# EAGLE schematic Nixie Test (EAGLE 6.5.0)

## Sheet 1 of 17
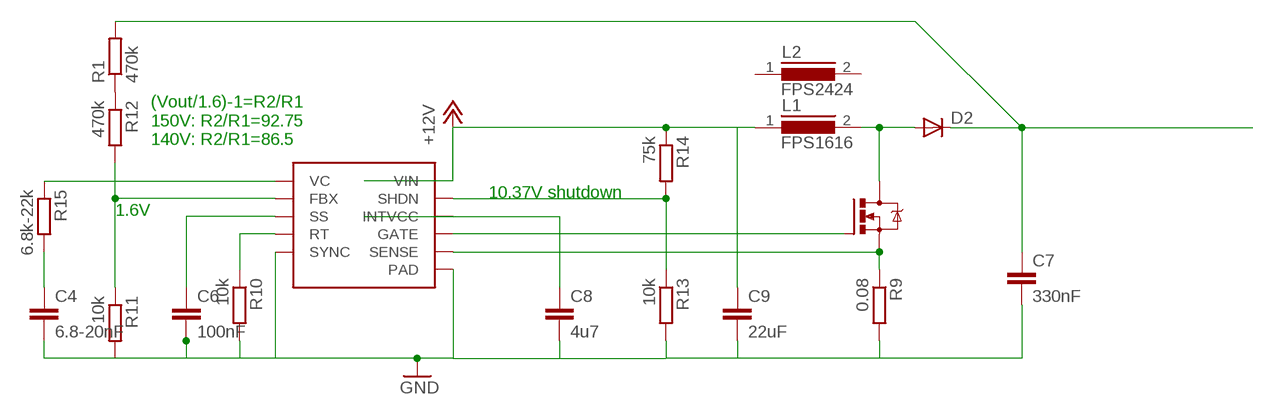
[diagram p0: schematic, sheet 1]

### Parts
C4  6.8-20nF  C-EUC0805K  [C0805K]
C6  100nF  C-EUC0805K  [C0805K]
C7  330nF  C-EUC1812  [C1812]
C8  4u7  C-EUC1206K  [C1206K]
C9  22uF  C-EUC1210K  [C1210K]
D2  DIODE-DO219AB  [DO219AB]
L1  FPS1616  [1616FPS_22UH]
L2  FPS2424  [242408FPS_22UH]
Q1  N-MOSFET-TO252-DPAK  [TO252]
R1  470k  R-EU_R0805  [R0805]
R9  0.08  R-EU_R0805  [R0805]
R10  10k  R-EU_R0805  [R0805]
R11  10k  R-EU_R0805  [R0805]
R12  470k  R-EU_R0805  [R0805]
R13  10k  R-EU_R0805  [R0805]
R14  75k  R-EU_R0805  [R0805]
R15  6.8k-22k  R-EU_R0805  [R0805]
U2  LT3757MSOP-10  [MSOP-10]

### Nets
+12V: C9.1 L1.1 R14.1 U2.10(VIN) ; also sheet 2,3,4,5,6,7,8,9,10,11,12
GND: C4.2 C6.2 C7.2 C8.2 C9.2 R9.2 R10.2 R11.2 R13.2 U2.5(SYNC) U2.PAD ; also sheet 2,3,4,5,6,7,8,9,10,11,12,13,14,15,16,17
N$1: R1.1 R12.1
N$19: Q1.1(G) U2.7(GATE)
N$20: R11.1 R12.2 U2.2(FBX)
N$21: D2.A L1.2 Q1.3(D)
N$22: C7.1 D2.C R1.2
N$23: C6.1 U2.3(SS)
N$24: R10.1 U2.4(RT)
N$25: Q1.2(S) R9.1 U2.6(SENSE)
N$26: R13.1 R14.2 U2.9(SHDN)
N$27: C4.1 R15.2
N$28: R15.1 U2.1(VC)
N$29: C8.1 U2.8(INTVCC)
Unconnected: L2.1 L2.2

### Notes on the sheet
- (Vout/1.6)-1=R2/R1
  150V: R2/R1=92.75
  140V: R2/R1=86.5
- 10.37V shutdown
- 1.6V

## Sheet 2 of 17
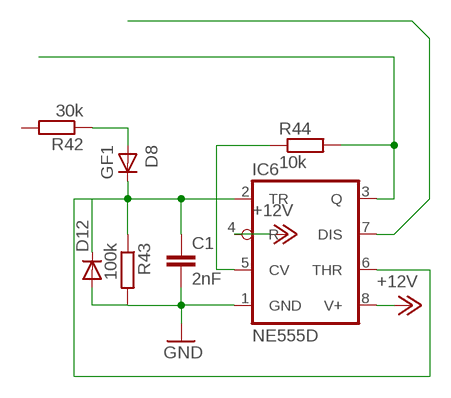
[diagram p1: schematic, sheet 2]

### Parts
C1  2nF  C-EUC1206K  [C1206K]
D8  GF1  [SMA-DO214AC]
D12  DIODE-DO214AA  [DO214AA]
IC6  NE555D  [SO08]
R42  30k  R-EU_R0805  [R0805]
R43  100k  R-EU_R0805  [R0805]
R44  10k  R-EU_R0805  [R0805]

### Nets
+12V: IC6.4(R) IC6.8(V+) ; also sheet 1,3,4,5,6,7,8,9,10,11,12
GND: C1.2 D12.A IC6.1(GND) R43.2 ; also sheet 1,3,4,5,6,7,8,9,10,11,12,13,14,15,16,17
N$2: IC6.7(DIS)
N$84: D8.A R42.1
N$85: IC6.3(Q) R44.2
N$86: IC6.5(CV) R44.1
N$90: C1.1 D8.K(C) D12.C IC6.2(TR) IC6.6(THR) R43.1
Unconnected: R42.2

## Sheet 3 of 17
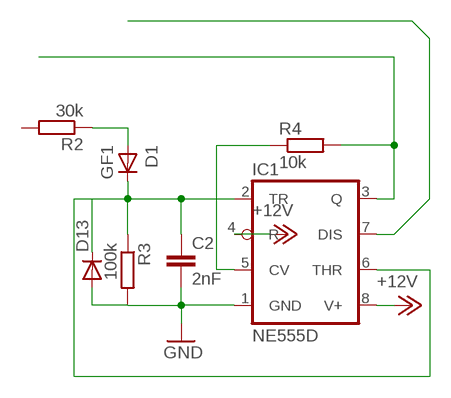
[diagram p2: schematic, sheet 3]

### Parts
C2  2nF  C-EUC1206K  [C1206K]
D1  GF1  [SMA-DO214AC]
D13  DIODE-DO214AA  [DO214AA]
IC1  NE555D  [SO08]
R2  30k  R-EU_R0805  [R0805]
R3  100k  R-EU_R0805  [R0805]
R4  10k  R-EU_R0805  [R0805]

### Nets
+12V: IC1.4(R) IC1.8(V+) ; also sheet 1,2,4,5,6,7,8,9,10,11,12
GND: C2.2 D13.A IC1.1(GND) R3.2 ; also sheet 1,2,4,5,6,7,8,9,10,11,12,13,14,15,16,17
N$10: D1.A R2.1
N$11: IC1.5(CV) R4.1
N$12: C2.1 D1.K(C) D13.C IC1.2(TR) IC1.6(THR) R3.1
N$13: IC1.3(Q) R4.2
N$14: IC1.7(DIS)
Unconnected: R2.2

## Sheet 4 of 17
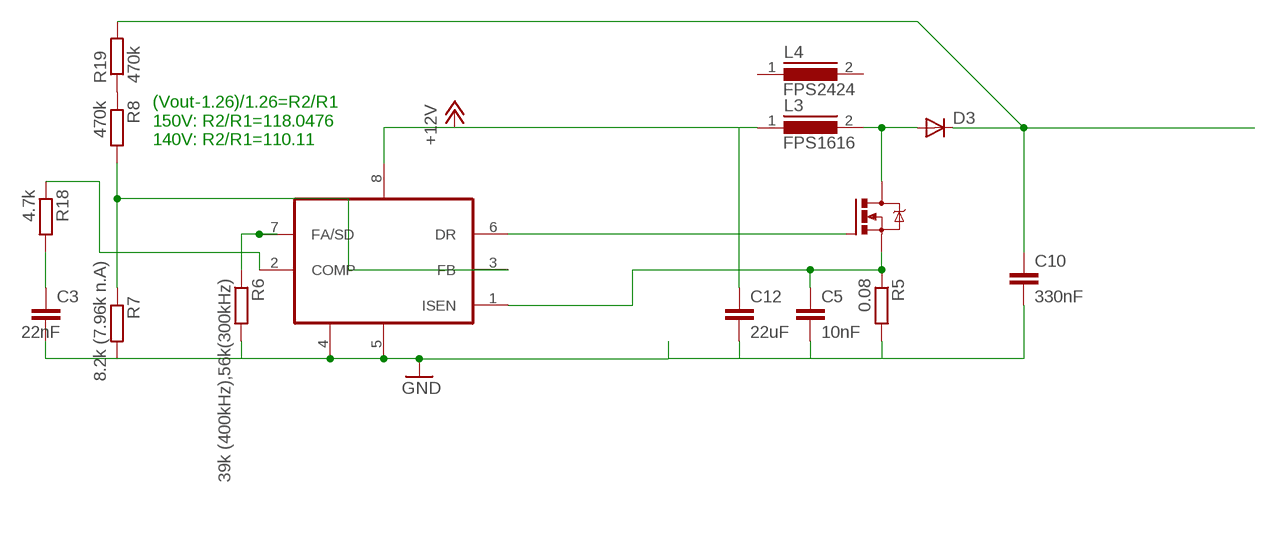
[diagram p3: schematic, sheet 4]

### Parts
C3  22nF  C-EUC0805K  [C0805K]
C5  10nF  C-EUC0805K  [C0805K]
C10  330nF  C-EUC1812  [C1812]
C12  22uF  C-EUC1210K  [C1210K]
D3  DIODE-DO219AB  [DO219AB]
L3  FPS1616  [1616FPS_22UH]
L4  FPS2424  [242408FPS_22UH]
Q2  N-MOSFET-TO252-DPAK  [TO252]
R5  0.08  R-EU_R0805  [R0805]
R6  39k (400kHz),56k(300kHz)  R-EU_R0805  [R0805]
R7  8.2k (7.96k n.A)  R-EU_R0805  [R0805]
R8  470k  R-EU_R0805  [R0805]
R18  4.7k  R-EU_R0805  [R0805]
R19  470k  R-EU_R0805  [R0805]
U3  LM3478  [MSOP08]

### Nets
+12V: C12.1 L3.1 U3.8(VIN) ; also sheet 1,2,3,5,6,7,8,9,10,11,12
GND: C3.2 C5.2 C10.2 C12.2 R5.2 R6.2 R7.2 U3.4(AGND) U3.5(PGND) ; also sheet 1,2,3,5,6,7,8,9,10,11,12,13,14,15,16,17
N$33: Q2.1(G) U3.6(DR)
N$34: R7.1 R8.2 U3.3(FB)
N$35: D3.A L3.2 Q2.3(D)
N$36: C10.1 D3.C R19.2
N$37: R18.1 U3.2(COMP)
N$38: R6.1 U3.7(FA/SD)
N$39: C5.1 Q2.2(S) R5.1 U3.1(ISEN)
N$41: C3.1 R18.2
N$44: R8.1 R19.1
Unconnected: L4.1 L4.2

### Notes on the sheet
- (Vout-1.26)/1.26=R2/R1
  150V: R2/R1=118.0476
  140V: R2/R1=110.11

## Sheet 5 of 17
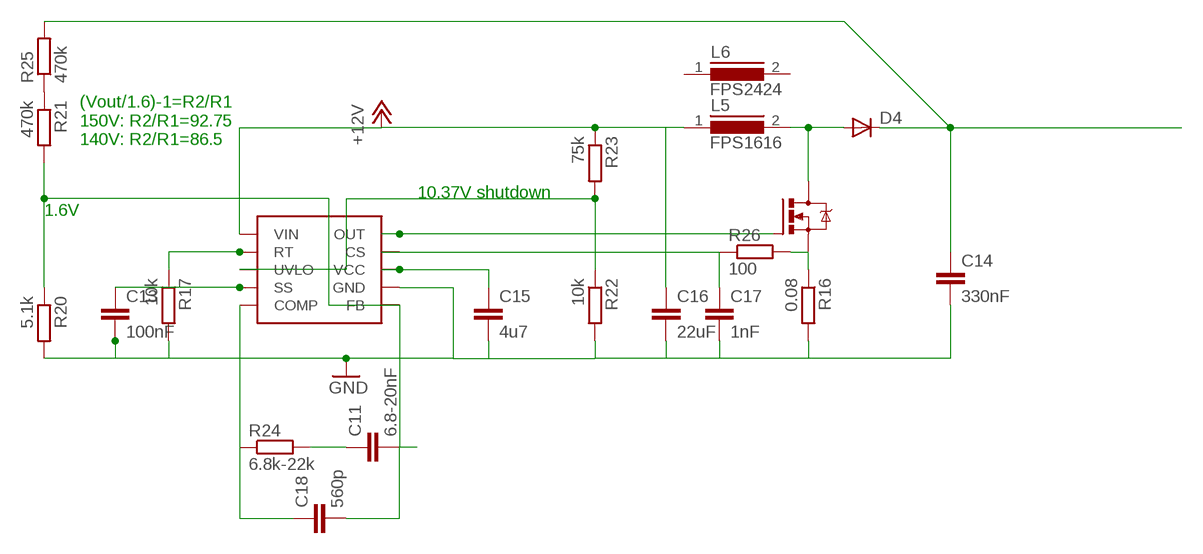
[diagram p4: schematic, sheet 5]

### Parts
C11  6.8-20nF  C-EUC0805K  [C0805K]
C13  100nF  C-EUC0805K  [C0805K]
C14  330nF  C-EUC1812  [C1812]
C15  4u7  C-EUC1206K  [C1206K]
C16  22uF  C-EUC1210K  [C1210K]
C17  1nF  C-EUC0805K  [C0805K]
C18  560p  C-EUC0805K  [C0805K]
D4  DIODE-DO219AB  [DO219AB]
L5  FPS1616  [1616FPS_22UH]
L6  FPS2424  [242408FPS_22UH]
Q3  N-MOSFET-TO252-DPAK  [TO252]
R16  0.08  R-EU_R0805  [R0805]
R17  10k  R-EU_R0805  [R0805]
R20  5.1k  R-EU_R0805  [R0805]
R21  470k  R-EU_R0805  [R0805]
R22  10k  R-EU_R0805  [R0805]
R23  75k  R-EU_R0805  [R0805]
R24  6.8k-22k  R-EU_R0805  [R0805]
R25  470k  R-EU_R0805  [R0805]
R26  100  R-EU_R0805  [R0805]
U4  LM5022MSOP-10  [MSOP-10-NOPAD]

### Nets
+12V: C16.1 L5.1 R23.1 U4.1(VIN) ; also sheet 1,2,3,4,6,7,8,9,10,11,12
GND: C13.2 C14.2 C15.2 C16.2 C17.2 R16.2 R17.2 R20.2 R22.2 U4.6(GND) ; also sheet 1,2,3,4,6,7,8,9,10,11,12,13,14,15,16,17
N$42: Q3.1(G) U4.5(OUT)
N$43: C11.2 C18.2 R20.1 R21.2 U4.2(FB)
N$45: D4.A L5.2 Q3.3(D)
N$46: C14.1 D4.C R25.2
N$47: C13.1 U4.10(SS)
N$48: R17.1 U4.9(RT)
N$49: Q3.2(S) R16.1 R26.2
N$50: R22.1 R23.2 U4.7(UVLO)
N$51: C11.1 R24.2
N$52: C18.1 R24.1 U4.3(COMP)
N$53: C15.1 U4.4(VCC)
N$54: R21.1 R25.1
N$55: C17.1 R26.1 U4.8(CS)
Unconnected: L6.1 L6.2

### Notes on the sheet
- (Vout/1.6)-1=R2/R1
  150V: R2/R1=92.75
  140V: R2/R1=86.5
- 10.37V shutdown
- 1.6V

## Sheet 6 of 17
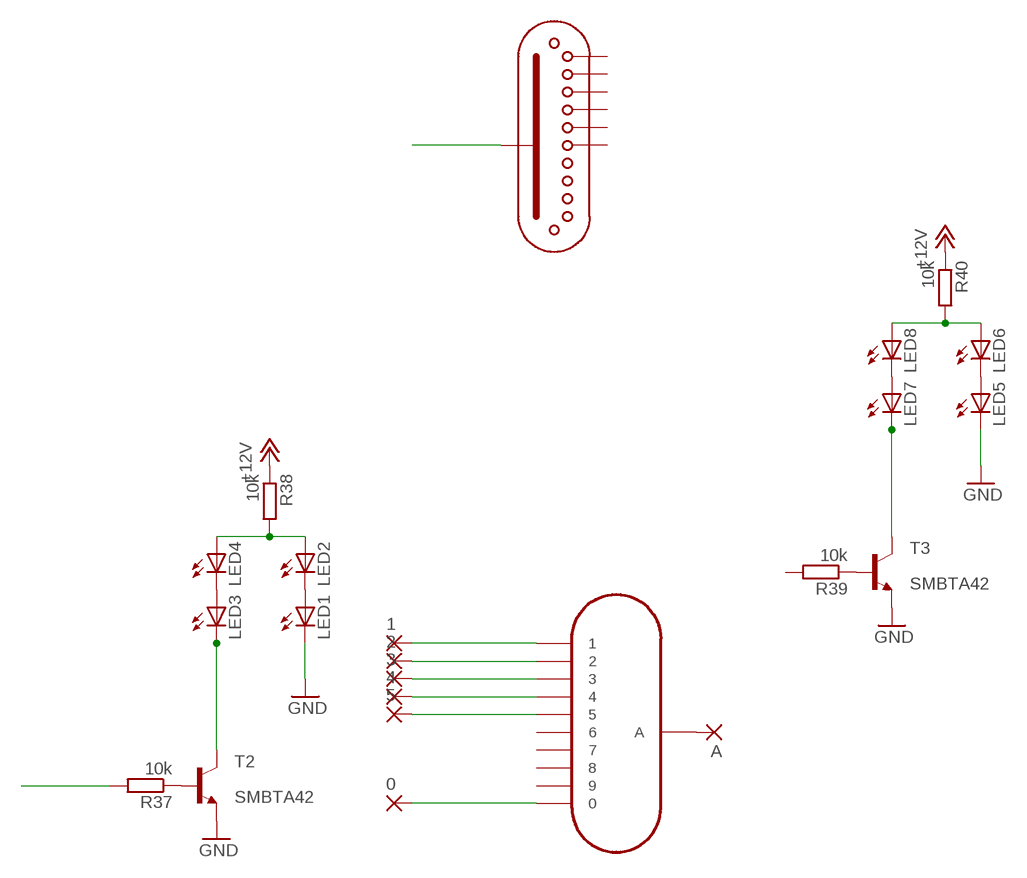
[diagram p5: schematic, sheet 6]

### Parts
0  SMD2  [SMD1,27-2,54]
1  SMD2  [SMD1,27-2,54]
2  SMD2  [SMD1,27-2,54]
3  SMD2  [SMD1,27-2,54]
4  SMD2  [SMD1,27-2,54]
5  SMD2  [SMD1,27-2,54]
A  SMD2  [SMD1,27-2,54]
LED1  LED3MM  [LED3MM]
LED2  LED3MM  [LED3MM]
LED3  LED3MM  [LED3MM]
LED4  LED3MM  [LED3MM]
LED5  LED3MM  [LED3MM]
LED6  LED3MM  [LED3MM]
LED7  LED3MM  [LED3MM]
LED8  LED3MM  [LED3MM]
N1  IN-12A-IN-12  [IN-12]
R37  10k  R-EU_R0805  [R0805]
R38  10k  R-EU_R0805  [R0805]
R39  10k  R-EU_R0805  [R0805]
R40  10k  R-EU_R0805  [R0805]
T2  MMBTA42LT1-NPN-SOT23-BEC  [SOT23-BEC]
T3  MMBTA42LT1-NPN-SOT23-BEC  [SOT23-BEC]
U$3  ZM1020  [ZM1020]

### Nets
+12V: R38.1 R40.1 ; also sheet 1,2,3,4,5,7,8,9,10,11,12
GND: LED1.K(C) LED5.K(C) T2.E T3.E ; also sheet 1,2,3,4,5,7,8,9,10,11,12,13,14,15,16,17
N$60: R37.2
N$91: LED1.A LED2.K(C)
N$92: LED3.A LED4.K(C)
N$93: R37.1 T2.B
N$94: LED3.K(C) T2.C
N$95: LED2.A LED4.A R38.2
N$96: U$3.12(A)
N$97: 0.1(P) N1.0
N$98: 1.1(P) N1.1
N$99: 2.1(P) N1.2
N$100: 3.1(P) N1.3
N$101: 4.1(P) N1.4
N$102: 5.1(P) N1.5
N$103: A.1(P) N1.A
N$104: LED5.A LED6.K(C)
N$105: LED7.A LED8.K(C)
N$106: R39.1 T3.B
N$107: LED7.K(C) T3.C
N$108: LED6.A LED8.A R40.2
Unconnected: N1.6 N1.7 N1.8 N1.9 R39.2 U$3.1 U$3.2 U$3.3 U$3.4 U$3.5 U$3.11

## Sheet 7 of 17
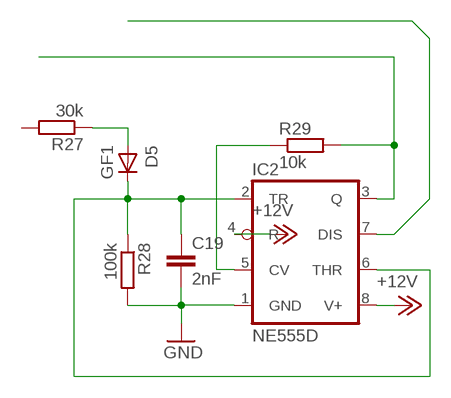
[diagram p6: schematic, sheet 7]

### Parts
C19  2nF  C-EUC1206K  [C1206K]
D5  GF1  [SMA-DO214AC]
IC2  NE555D  [SO08]
R27  30k  R-EU_R0805  [R0805]
R28  100k  R-EU_R0805  [R0805]
R29  10k  R-EU_R0805  [R0805]

### Nets
+12V: IC2.4(R) IC2.8(V+) ; also sheet 1,2,3,4,5,6,8,9,10,11,12
GND: C19.2 IC2.1(GND) R28.2 ; also sheet 1,2,3,4,5,6,8,9,10,11,12,13,14,15,16,17
N$58: D5.A R27.1
N$59: IC2.5(CV) R29.1
N$61: C19.1 D5.K(C) IC2.2(TR) IC2.6(THR) R28.1
N$62: IC2.3(Q) R29.2
N$63: IC2.7(DIS)
Unconnected: R27.2

## Sheet 8 of 17
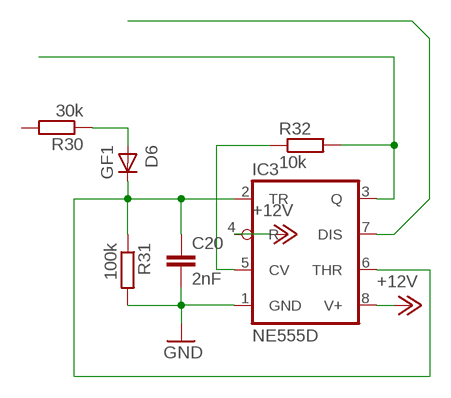
[diagram p7: schematic, sheet 8]

### Parts
C20  2nF  C-EUC1206K  [C1206K]
D6  GF1  [SMA-DO214AC]
IC3  NE555D  [SO08]
R30  30k  R-EU_R0805  [R0805]
R31  100k  R-EU_R0805  [R0805]
R32  10k  R-EU_R0805  [R0805]

### Nets
+12V: IC3.4(R) IC3.8(V+) ; also sheet 1,2,3,4,5,6,7,9,10,11,12
GND: C20.2 IC3.1(GND) R31.2 ; also sheet 1,2,3,4,5,6,7,9,10,11,12,13,14,15,16,17
N$71: D6.A R30.1
N$72: IC3.5(CV) R32.1
N$73: C20.1 D6.K(C) IC3.2(TR) IC3.6(THR) R31.1
N$75: IC3.3(Q) R32.2
N$76: IC3.7(DIS)
Unconnected: R30.2

## Sheet 9 of 17
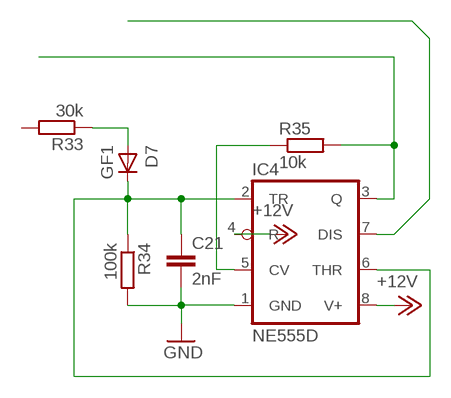
[diagram p8: schematic, sheet 9]

### Parts
C21  2nF  C-EUC1206K  [C1206K]
D7  GF1  [SMA-DO214AC]
IC4  NE555D  [SO08]
R33  30k  R-EU_R0805  [R0805]
R34  100k  R-EU_R0805  [R0805]
R35  10k  R-EU_R0805  [R0805]

### Nets
+12V: IC4.4(R) IC4.8(V+) ; also sheet 1,2,3,4,5,6,7,8,10,11,12
GND: C21.2 IC4.1(GND) R34.2 ; also sheet 1,2,3,4,5,6,7,8,10,11,12,13,14,15,16,17
N$87: D7.A R33.1
N$88: IC4.5(CV) R35.1
N$89: C21.1 D7.K(C) IC4.2(TR) IC4.6(THR) R34.1
N$123: IC4.3(Q) R35.2
N$124: IC4.7(DIS)
Unconnected: R33.2

## Sheet 10 of 17
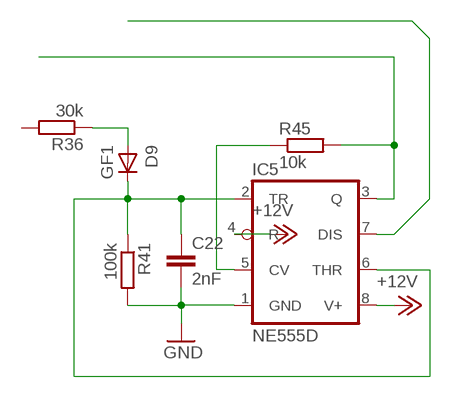
[diagram p9: schematic, sheet 10]

### Parts
C22  2nF  C-EUC1206K  [C1206K]
D9  GF1  [SMA-DO214AC]
IC5  NE555D  [SO08]
R36  30k  R-EU_R0805  [R0805]
R41  100k  R-EU_R0805  [R0805]
R45  10k  R-EU_R0805  [R0805]

### Nets
+12V: IC5.4(R) IC5.8(V+) ; also sheet 1,2,3,4,5,6,7,8,9,11,12
GND: C22.2 IC5.1(GND) R41.2 ; also sheet 1,2,3,4,5,6,7,8,9,11,12,13,14,15,16,17
N$132: D9.A R36.1
N$133: IC5.5(CV) R45.1
N$134: C22.1 D9.K(C) IC5.2(TR) IC5.6(THR) R41.1
N$135: IC5.3(Q) R45.2
N$136: IC5.7(DIS)
Unconnected: R36.2

## Sheet 11 of 17
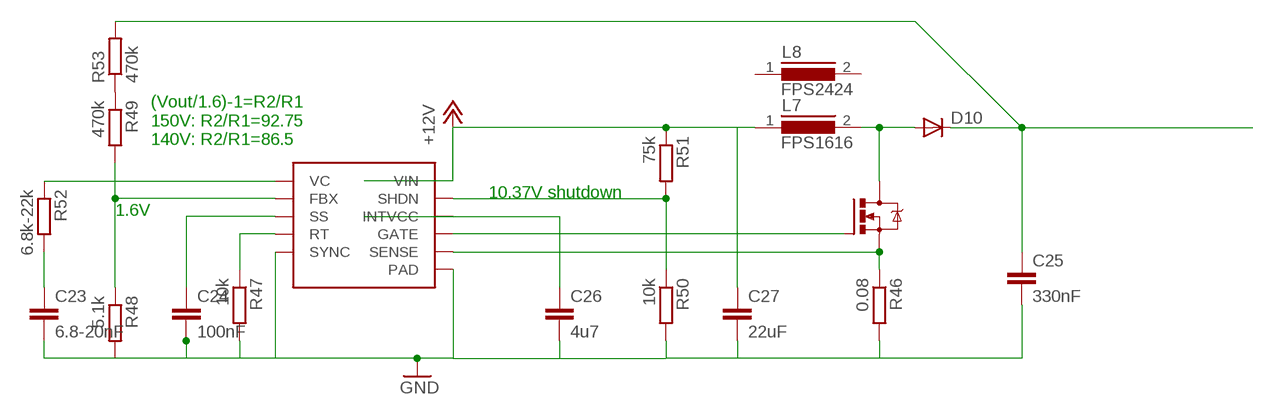
[diagram p10: schematic, sheet 11]

### Parts
C23  6.8-20nF  C-EUC0805K  [C0805K]
C24  100nF  C-EUC0805K  [C0805K]
C25  330nF  C-EUC1812  [C1812]
C26  4u7  C-EUC1206K  [C1206K]
C27  22uF  C-EUC1210K  [C1210K]
D10  DIODE-DO219AB  [DO219AB]
L7  FPS1616  [1616FPS_22UH]
L8  FPS2424  [242408FPS_22UH]
Q4  N-MOSFET-TO252-DPAK  [TO252]
R46  0.08  R-EU_R0805  [R0805]
R47  10k  R-EU_R0805  [R0805]
R48  5.1k  R-EU_R0805  [R0805]
R49  470k  R-EU_R0805  [R0805]
R50  10k  R-EU_R0805  [R0805]
R51  75k  R-EU_R0805  [R0805]
R52  6.8k-22k  R-EU_R0805  [R0805]
R53  470k  R-EU_R0805  [R0805]
U1  LT3757MSOP-10  [MSOP-10]

### Nets
+12V: C27.1 L7.1 R51.1 U1.10(VIN) ; also sheet 1,2,3,4,5,6,7,8,9,10,12
GND: C23.2 C24.2 C25.2 C26.2 C27.2 R46.2 R47.2 R48.2 R50.2 U1.5(SYNC) U1.PAD ; also sheet 1,2,3,4,5,6,7,8,9,10,12,13,14,15,16,17
N$144: Q4.1(G) U1.7(GATE)
N$145: R48.1 R49.2 U1.2(FBX)
N$146: D10.A L7.2 Q4.3(D)
N$147: C25.1 D10.C R53.2
N$148: C24.1 U1.3(SS)
N$149: R47.1 U1.4(RT)
N$150: Q4.2(S) R46.1 U1.6(SENSE)
N$151: R50.1 R51.2 U1.9(SHDN)
N$152: C23.1 R52.2
N$153: R52.1 U1.1(VC)
N$154: C26.1 U1.8(INTVCC)
N$155: R49.1 R53.1
Unconnected: L8.1 L8.2

### Notes on the sheet
- (Vout/1.6)-1=R2/R1
  150V: R2/R1=92.75
  140V: R2/R1=86.5
- 10.37V shutdown
- 1.6V

## Sheet 12 of 17
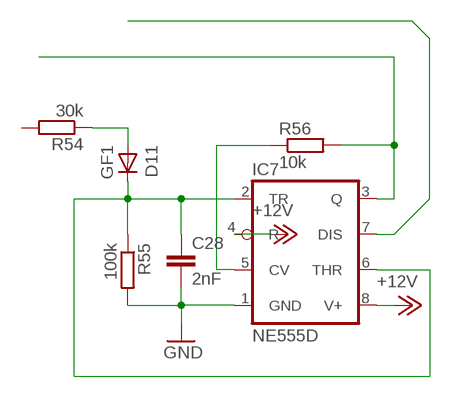
[diagram p11: schematic, sheet 12]

### Parts
C28  2nF  C-EUC1206K  [C1206K]
D11  GF1  [SMA-DO214AC]
IC7  NE555D  [SO08]
R54  30k  R-EU_R0805  [R0805]
R55  100k  R-EU_R0805  [R0805]
R56  10k  R-EU_R0805  [R0805]

### Nets
+12V: IC7.4(R) IC7.8(V+) ; also sheet 1,2,3,4,5,6,7,8,9,10,11
GND: C28.2 IC7.1(GND) R55.2 ; also sheet 1,2,3,4,5,6,7,8,9,10,11,13,14,15,16,17
N$159: D11.A R54.1
N$160: IC7.5(CV) R56.1
N$161: C28.1 D11.K(C) IC7.2(TR) IC7.6(THR) R55.1
N$162: IC7.3(Q) R56.2
N$163: IC7.7(DIS)
Unconnected: R54.2

## Sheet 13 of 17
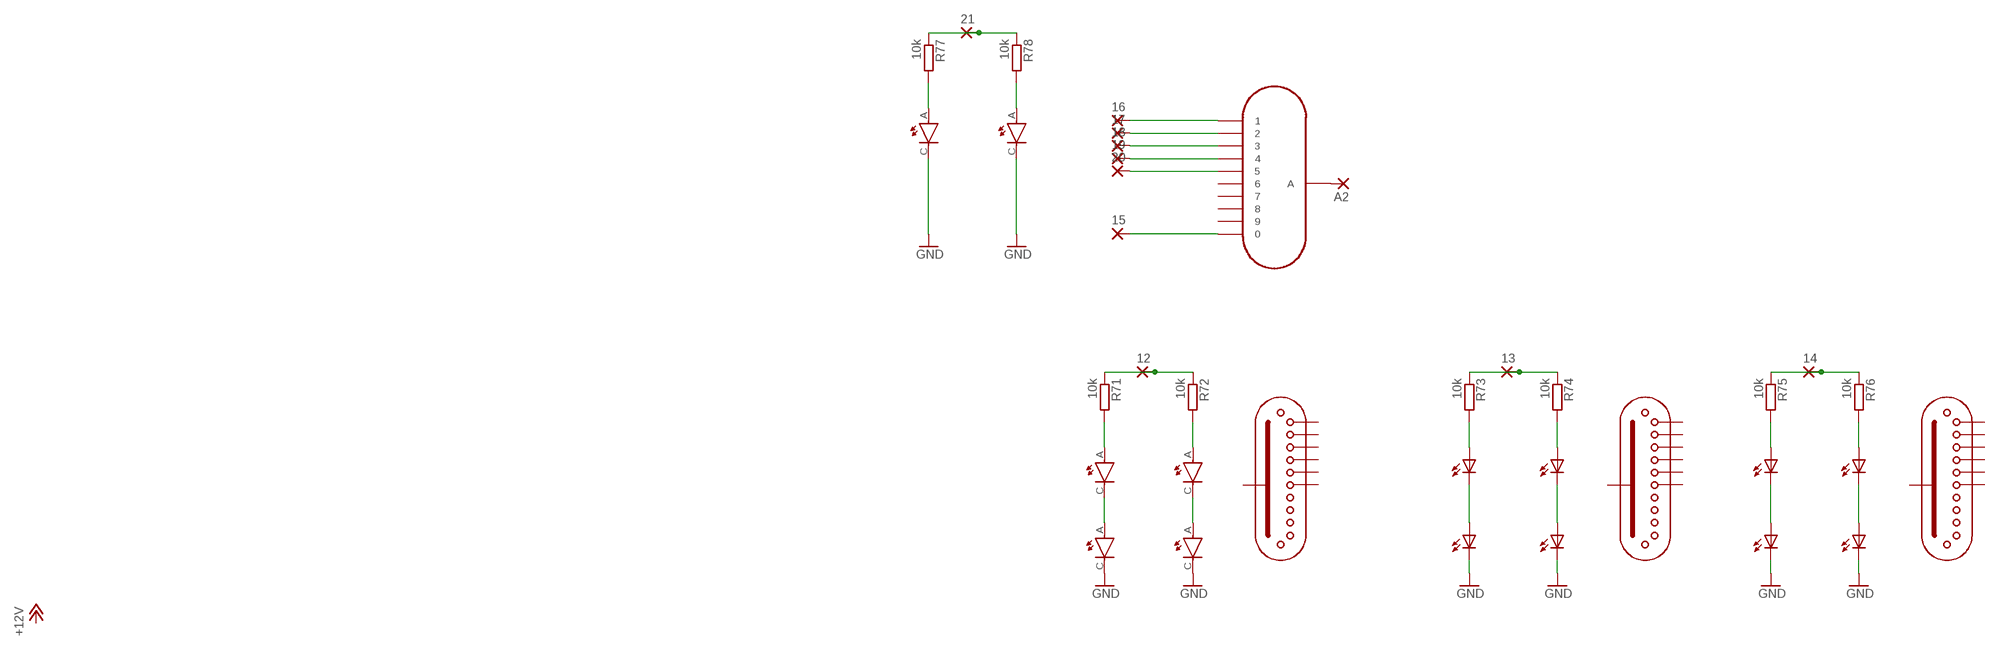
[diagram p12: schematic, sheet 13]

### Parts
12  SMD2  [SMD1,27-2,54]
13  SMD2  [SMD1,27-2,54]
14  SMD2  [SMD1,27-2,54]
15  SMD2  [SMD1,27-2,54]
16  SMD2  [SMD1,27-2,54]
17  SMD2  [SMD1,27-2,54]
18  SMD2  [SMD1,27-2,54]
19  SMD2  [SMD1,27-2,54]
20  SMD2  [SMD1,27-2,54]
21  SMD2  [SMD1,27-2,54]
A2  SMD2  [SMD1,27-2,54]
LED17  LED_PLCC6  [PLCC6]
LED18  LED_PLCC6  [PLCC6]
LED19  LED_PLCC6  [PLCC6]
LED20  LED_PLCC6  [PLCC6]
LED21  LED_LRTB_G6TG  [PLCC6]
LED22  LED_LRTB_G6TG  [PLCC6]
N3  IN-12A-IN-12  [IN-12]
R71  10k  R-EU_R0805  [R0805]
R72  10k  R-EU_R0805  [R0805]
R73  10k  R-EU_R0805  [R0805]
R74  10k  R-EU_R0805  [R0805]
R75  10k  R-EU_R0805  [R0805]
R76  10k  R-EU_R0805  [R0805]
R77  10k  R-EU_R0805  [R0805]
R78  10k  R-EU_R0805  [R0805]
U$5  PLCC2  [PLCC2]
U$6  PLCC2  [PLCC2]
U$7  ZM1020  [ZM1020]
U$8  PLCC2  [PLCC2]
U$9  PLCC2  [PLCC2]
U$10  ZM1020  [ZM1020]
U$11  ZM1020  [ZM1020]
U$12  PLCC2  [PLCC2]
U$13  PLCC2  [PLCC2]

### Nets
GND: LED18.C3(C) LED20.C3(C) LED22.C2(G:C) LED22.C3(B:C) U$8.C U$9.C U$12.C U$13.C ; also sheet 1,2,3,4,5,6,7,8,9,10,11,12,14,15,16,17
N$219: U$5.C U$8.A
N$220: U$6.C U$9.A
N$221: R72.2 U$6.A
N$222: R71.2 U$5.A
N$223: 12.1(P) R71.1 R72.1
N$224: LED17.C3(C) LED18.A3(A)
N$225: LED19.C3(C) LED20.A3(A)
N$226: LED19.A3(A) R74.2
N$227: LED17.A3(A) R73.2
N$228: 13.1(P) R73.1 R74.1
N$229: LED21.C2(G:C) LED22.A2(G:A)
N$230: LED21.C3(B:C) LED22.A3(B:A)
N$231: LED21.A3(B:A) R76.2
N$232: LED21.A2(G:A) R75.2
N$233: 14.1(P) R75.1 R76.1
N$234: 15.1(P) N3.0
N$235: 16.1(P) N3.1
N$236: 17.1(P) N3.2
N$237: 18.1(P) N3.3
N$238: 19.1(P) N3.4
N$239: 20.1(P) N3.5
N$240: A2.1(P) N3.A
N$241: R78.2 U$13.A
N$242: R77.2 U$12.A
N$243: 21.1(P) R77.1 R78.1
Unconnected: LED21.A1(R:A) LED21.C1(R:C) LED22.A1(R:A) LED22.C1(R:C) N3.6 N3.7 N3.8 N3.9 U$7.1 U$7.2 U$7.3 U$7.4 U$7.5 U$7.11 U$7.12(A) U$10.1 U$10.2 U$10.3 U$10.4 U$10.5 U$10.11 U$10.12(A) U$11.1 U$11.2 U$11.3 U$11.4 U$11.5 U$11.11 U$11.12(A)

## Sheet 14 of 17
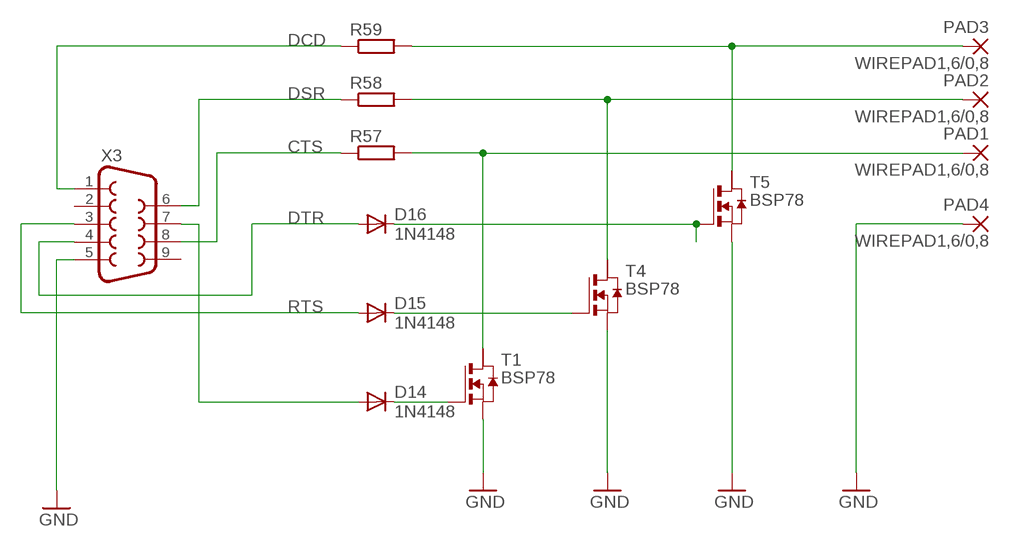
[diagram p13: schematic, sheet 14]

### Parts
D14  1N4148  DIODE-SOD323-W  [SOD323-W]
D15  1N4148  DIODE-SOD323-W  [SOD323-W]
D16  1N4148  DIODE-SOD323-W  [SOD323-W]
PAD1  WIREPAD1,6/0,8  [1,6/0,8]
PAD2  WIREPAD1,6/0,8  [1,6/0,8]
PAD3  WIREPAD1,6/0,8  [1,6/0,8]
PAD4  WIREPAD1,6/0,8  [1,6/0,8]
R57  R-EU_R0805  [R0805]
R58  R-EU_R0805  [R0805]
R59  R-EU_R0805  [R0805]
T1  BSP78  NMOSSOT223  [SOT223]
T4  BSP78  NMOSSOT223  [SOT223]
T5  BSP78  NMOSSOT223  [SOT223]
X3  F09D  [F09D]

### Nets
CTS: R57.1 X3.8 ; also sheet 15,16,17
DCD: R59.1 X3.1 ; also sheet 15,16,17
DSR: R58.1 X3.6 ; also sheet 15,16,17
DTR: D16.A X3.4 ; also sheet 15,16,17
GND: PAD4.1(P) T1.3(S) T4.3(S) T5.3(S) X3.5 ; also sheet 1,2,3,4,5,6,7,8,9,10,11,12,13,15,16,17
N$177: D16.C T5.1(G)
N$178: D15.C T4.1(G)
N$179: D14.C T1.1(G)
N$180: PAD1.1(P) R57.2 T1.2(D)
N$181: PAD2.1(P) R58.2 T4.2(D)
N$182: PAD3.1(P) R59.2 T5.2(D)
N$183: D14.A X3.7
RTS: D15.A X3.3 ; also sheet 15,16,17
Unconnected: T1.4(D2) T4.4(D2) T5.4(D2) X3.2 X3.9

## Sheet 15 of 17
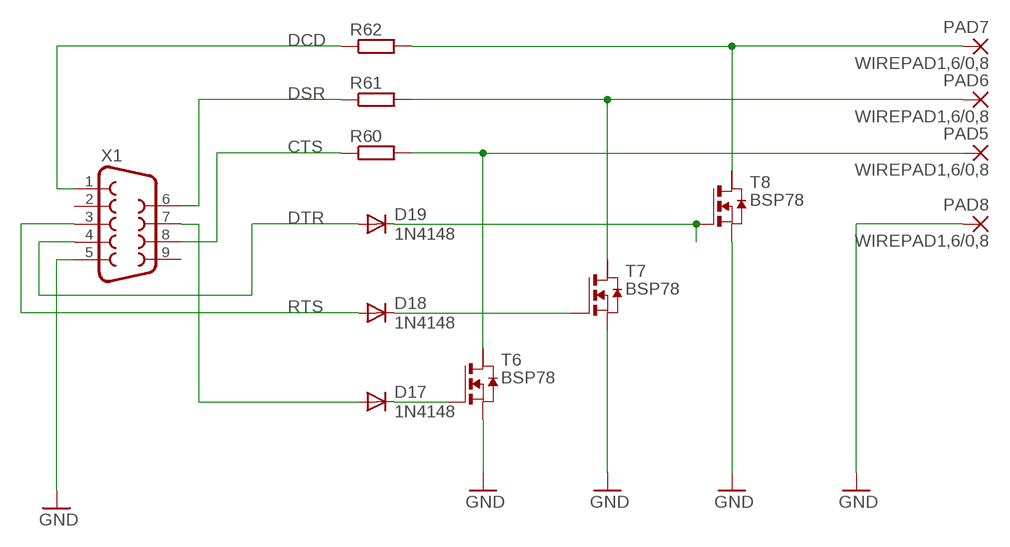
[diagram p14: schematic, sheet 15]

### Parts
D17  1N4148  DIODE-SOD323-W  [SOD323-W]
D18  1N4148  DIODE-SOD323-W  [SOD323-W]
D19  1N4148  DIODE-SOD323-W  [SOD323-W]
PAD5  WIREPAD1,6/0,8  [1,6/0,8]
PAD6  WIREPAD1,6/0,8  [1,6/0,8]
PAD7  WIREPAD1,6/0,8  [1,6/0,8]
PAD8  WIREPAD1,6/0,8  [1,6/0,8]
R60  R-EU_R0805  [R0805]
R61  R-EU_R0805  [R0805]
R62  R-EU_R0805  [R0805]
T6  BSP78  NMOSSOT223  [SOT223]
T7  BSP78  NMOSSOT223  [SOT223]
T8  BSP78  NMOSSOT223  [SOT223]
X1  F09D  [F09D]

### Nets
CTS: R60.1 X1.8 ; also sheet 14,16,17
DCD: R62.1 X1.1 ; also sheet 14,16,17
DSR: R61.1 X1.6 ; also sheet 14,16,17
DTR: D19.A X1.4 ; also sheet 14,16,17
GND: PAD8.1(P) T6.3(S) T7.3(S) T8.3(S) X1.5 ; also sheet 1,2,3,4,5,6,7,8,9,10,11,12,13,14,16,17
N$184: D19.C T8.1(G)
N$185: D18.C T7.1(G)
N$186: D17.C T6.1(G)
N$187: PAD5.1(P) R60.2 T6.2(D)
N$188: PAD6.1(P) R61.2 T7.2(D)
N$189: PAD7.1(P) R62.2 T8.2(D)
N$190: D17.A X1.7
RTS: D18.A X1.3 ; also sheet 14,16,17
Unconnected: T6.4(D2) T7.4(D2) T8.4(D2) X1.2 X1.9

## Sheet 16 of 17
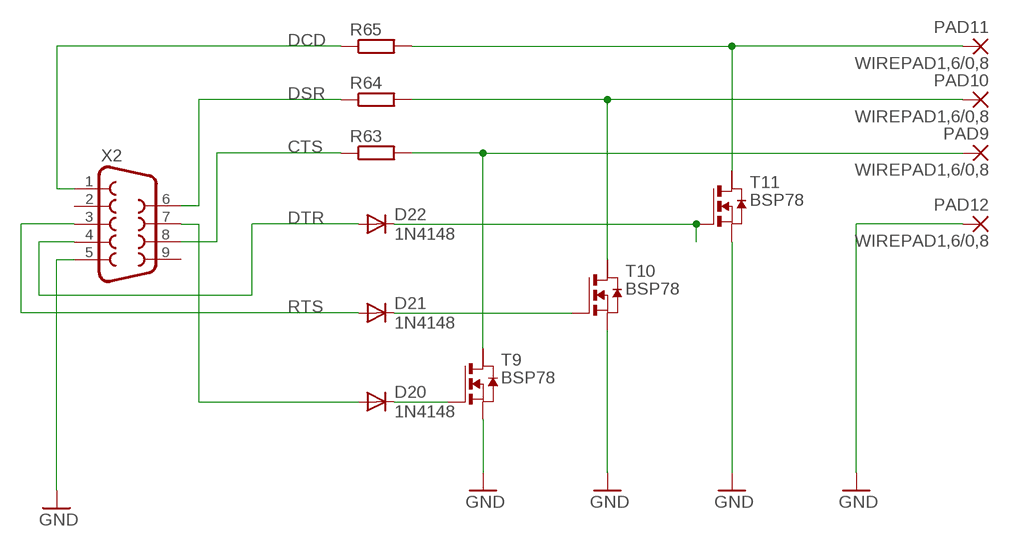
[diagram p15: schematic, sheet 16]

### Parts
D20  1N4148  DIODE-SOD323-W  [SOD323-W]
D21  1N4148  DIODE-SOD323-W  [SOD323-W]
D22  1N4148  DIODE-SOD323-W  [SOD323-W]
PAD9  WIREPAD1,6/0,8  [1,6/0,8]
PAD10  WIREPAD1,6/0,8  [1,6/0,8]
PAD11  WIREPAD1,6/0,8  [1,6/0,8]
PAD12  WIREPAD1,6/0,8  [1,6/0,8]
R63  R-EU_R0805  [R0805]
R64  R-EU_R0805  [R0805]
R65  R-EU_R0805  [R0805]
T9  BSP78  NMOSSOT223  [SOT223]
T10  BSP78  NMOSSOT223  [SOT223]
T11  BSP78  NMOSSOT223  [SOT223]
X2  F09D  [F09D]

### Nets
CTS: R63.1 X2.8 ; also sheet 14,15,17
DCD: R65.1 X2.1 ; also sheet 14,15,17
DSR: R64.1 X2.6 ; also sheet 14,15,17
DTR: D22.A X2.4 ; also sheet 14,15,17
GND: PAD12.1(P) T9.3(S) T10.3(S) T11.3(S) X2.5 ; also sheet 1,2,3,4,5,6,7,8,9,10,11,12,13,14,15,17
N$191: D22.C T11.1(G)
N$192: D21.C T10.1(G)
N$193: D20.C T9.1(G)
N$194: PAD9.1(P) R63.2 T9.2(D)
N$195: PAD10.1(P) R64.2 T10.2(D)
N$196: PAD11.1(P) R65.2 T11.2(D)
N$197: D20.A X2.7
RTS: D21.A X2.3 ; also sheet 14,15,17
Unconnected: T9.4(D2) T10.4(D2) T11.4(D2) X2.2 X2.9

## Sheet 17 of 17
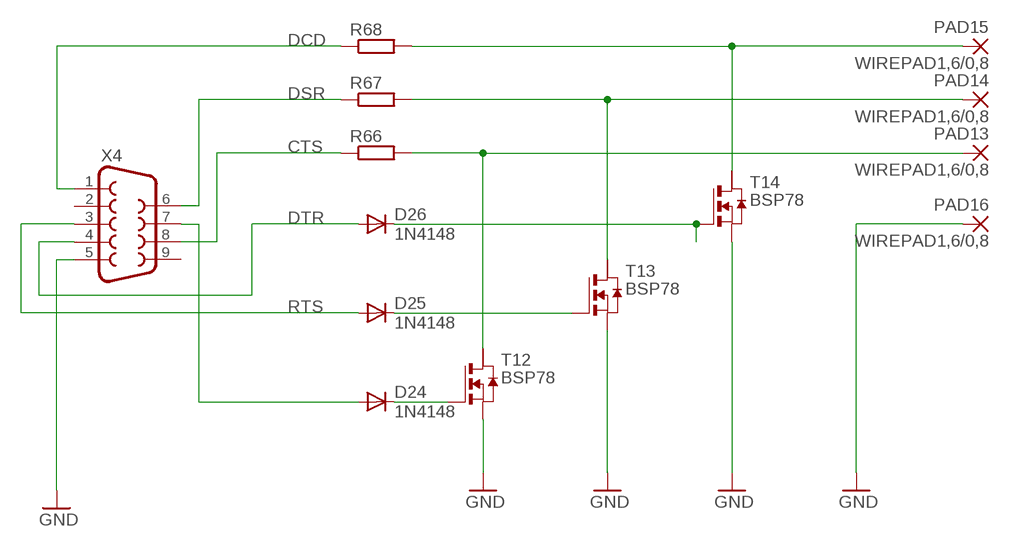
[diagram p16: schematic, sheet 17]

### Parts
D24  1N4148  DIODE-SOD323-W  [SOD323-W]
D25  1N4148  DIODE-SOD323-W  [SOD323-W]
D26  1N4148  DIODE-SOD323-W  [SOD323-W]
PAD13  WIREPAD1,6/0,8  [1,6/0,8]
PAD14  WIREPAD1,6/0,8  [1,6/0,8]
PAD15  WIREPAD1,6/0,8  [1,6/0,8]
PAD16  WIREPAD1,6/0,8  [1,6/0,8]
R66  R-EU_R0805  [R0805]
R67  R-EU_R0805  [R0805]
R68  R-EU_R0805  [R0805]
T12  BSP78  NMOSSOT223  [SOT223]
T13  BSP78  NMOSSOT223  [SOT223]
T14  BSP78  NMOSSOT223  [SOT223]
X4  F09D  [F09D]

### Nets
CTS: R66.1 X4.8 ; also sheet 14,15,16
DCD: R68.1 X4.1 ; also sheet 14,15,16
DSR: R67.1 X4.6 ; also sheet 14,15,16
DTR: D26.A X4.4 ; also sheet 14,15,16
GND: PAD16.1(P) T12.3(S) T13.3(S) T14.3(S) X4.5 ; also sheet 1,2,3,4,5,6,7,8,9,10,11,12,13,14,15,16
N$198: D26.C T14.1(G)
N$199: D25.C T13.1(G)
N$200: D24.C T12.1(G)
N$201: PAD13.1(P) R66.2 T12.2(D)
N$202: PAD14.1(P) R67.2 T13.2(D)
N$203: PAD15.1(P) R68.2 T14.2(D)
N$204: D24.A X4.7
RTS: D25.A X4.3 ; also sheet 14,15,16
Unconnected: T12.4(D2) T13.4(D2) T14.4(D2) X4.2 X4.9

## Library data of the parts
0 1-5 12-21 A A2 = wirepad:SMD2: SMD PAD
C1-C28 = rcl:C-EU: CAPACITOR, European symbol
D1 D5-D9 D11 = diode:GF1: DIODE
D2-D4 D10 = diode_extended:DIODE-: DIODE
D12-D22 D24-D26 = diode:DIODE-: DIODE
IC1-IC7 = linear:*555: TIMER
L1-L8 = inductor_power:FPS: High Power Density, High Efficiency, Shielded Inductors Source: coiltronics_dr_series.pdf
LED1-LED8 = led:LED: LED OSRAM: - CHIPLED LG R971, LG N971, LY N971, LG Q971, LY Q971, LO R971, LY R971 LH N974, LH R974 LS Q976, LO Q976, LY Q976 LO Q996 - Hyper CHIPLED LW Q18S LB Q993, LB Q99A, LB R99A - SideLED LS A670, LO A670, LY A670, LG A670, LP A670 LB A673, LV A673, LT A673, LW A673 LH A674 LY A675 LS A676, LA A676, LO A676, LY A676, LW A676 LS A679, LY A679, LG A679 - Hyper Micro SIDELED® LS Y876, LA Y876, LO Y876, LY Y876 LT Y87S - SmartLED LW L88C, LW L88S LB L89C, LB L89S, LG L890 LS L89K, LO L89K, LY L89K LS L896, LA L896, LO L896, LY L896 - TOPLED LS T670, LO T670, LY T670, LG T670, LP T670 LSG T670, LSP T670, LSY T670, LOP T670, LYG T670 LG T671, LOG T671, LSG T671 LB T673, LV T673, LT T673, LW T673 LH T674 LS T676, LA T676, LO T676, LY T676, LB T676, LH T676, LSB T676, LW T676 LB T67C, LV T67C, LT T67C, LS T67K, LO T67K, LY T67K, LW E67C LS E67B, LA E67B, LO E67B, LY E67B, LB E67C, LV E67C, LT E67C LW T67C LS T679, LY T679, LG T679 LS T770, LO T770, LY T770, LG T770, LP T770 LB T773, LV T773, LT T773, LW T773 LH T774 LS E675, LA E675, LY E675, LS T675 LS T776, LA T776, LO T776, LY T776, LB T776 LHGB T686 LT T68C, LB T68C - Hyper Mini TOPLED® LB M676 - Mini TOPLED Santana® LG M470 LS M47K, LO M47K, LY M47K Source: http://www.osram.convergy.de LUXEON: - LUMILED® LXK2-PW12-R00, LXK2-PW12-S00, LXK2-PW14-U00, LXK2-PW14-V00 LXK2-PM12-R00, LXK2-PM12-S00, LXK2-PM14-U00 LXK2-PE12-Q00, LXK2-PE12-R00, LXK2-PE12-S00, LXK2-PE14-T00, LXK2-PE14-U00 LXK2-PB12-K00, LXK2-PB12-L00, LXK2-PB12-M00, LXK2-PB14-N00, LXK2-PB14-P00, LXK2-PB14-Q00 LXK2-PR12-L00, LXK2-PR12-M00, LXK2-PR14-Q00, LXK2-PR14-R00 LXK2-PD12-Q00, LXK2-PD12-R00, LXK2-PD12-S00 LXK2-PH12-R00, LXK2-PH12-S00 LXK2-PL12-P00, LXK2-PL12-Q00, LXK2-PL12-R00 Source: www.luxeon.com KINGBRIGHT: KA-3528ASYC Source: www.kingbright.com
LED17-LED20 = LED_PLCC6:LED_PLCC6
LED21 LED22 = LED_RGB_PLCC6_G6TG:LED_LRTB_G6TG
N1 N3 = IN-12A:IN-12A
PAD1-PAD16 = wirepad:WIREPAD: Wire PAD connect wire on PCB
Q1-Q4 = N-MOSFET:N-MOSFET
R1-R68 R71-R78 = rcl:R-EU_: RESISTOR, European symbol
T1 T4-T14 = zetex:NMOSSOT223: MOS FET
T2 T3 = transistor:*-NPN-: NPN Transistror BF959 corrected 2008.03.06; T: SMBTA42
U1 U2 = LT3757:LT3757
U3 = LM3478:LM3478
U4 = LM5022:LM5022
U$3 U$7 U$10 U$11 = ZM1020:ZM1020
U$5 U$6 U$8 U$9 U$12 U$13 = LED_PLCC2:PLCC2
X1-X4 = con-subd:F09: SUB-D; OC_FARNELL: unknown; OC_NEWARK: unknown